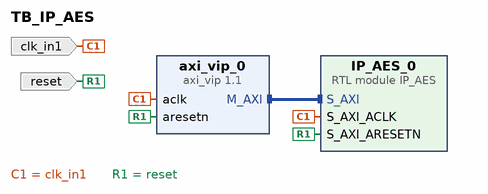
[diagram p0: block diagram of the top level]
# Vivado block design TB_IP_AES, xc7z020clg400-1, Vivado 2023.2.2
create_bd_design TB_IP_AES

create_bd_port -dir I -type clk clk_in1
create_bd_port -dir I -type rst reset
set_property -dict {CONFIG.POLARITY ACTIVE_LOW} [get_bd_ports reset]

create_bd_cell -type ip -vlnv xilinx.com:ip:axi_vip:1.1 axi_vip_0
set_property -dict [list \
  CONFIG.ADDR_WIDTH 32 \
  CONFIG.DATA_WIDTH 32 \
  CONFIG.HAS_BRESP 1 \
  CONFIG.HAS_PROT 1 \
  CONFIG.HAS_RRESP 1 \
  CONFIG.HAS_WSTRB 1 \
  CONFIG.INTERFACE_MODE MASTER \
  CONFIG.PROTOCOL AXI4LITE \
  CONFIG.READ_WRITE_MODE READ_WRITE \
] [get_bd_cells axi_vip_0]
create_bd_cell -type module -reference IP_AES IP_AES_0

# ---- connections ----

connect_bd_intf_net [get_bd_intf_pins axi_vip_0/M_AXI] [get_bd_intf_pins IP_AES_0/S_AXI]
connect_bd_net -net clk_wiz_clk_out1 [get_bd_ports clk_in1] [get_bd_pins IP_AES_0/S_AXI_ACLK] [get_bd_pins axi_vip_0/aclk]
connect_bd_net -net rst_clk_wiz_100M_peripheral_aresetn [get_bd_ports reset] [get_bd_pins IP_AES_0/S_AXI_ARESETN] [get_bd_pins axi_vip_0/aresetn]

# ---- address map ----
assign_bd_address -offset 0x00000000 -range 4G -target_address_space [get_bd_addr_spaces axi_vip_0/Master_AXI] [get_bd_addr_segs IP_AES_0/S_AXI/reg0]

validate_bd_design
save_bd_design
